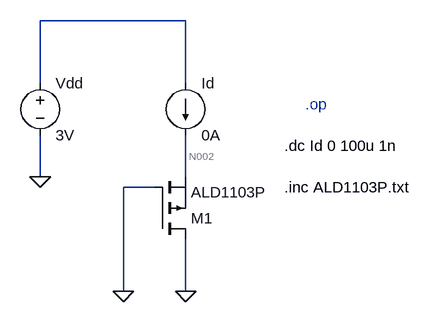
[diagram p0: schematic hw3 pmos sim.asc]
hw3 pmos sim.asc, the LTspice schematic file:
Version 4.1
SHEET 1 880 680
WIRE 224 -208 0 -208
WIRE 0 -112 0 -208
WIRE 224 -112 224 -208
WIRE 0 32 0 -32
WIRE 224 32 224 -32
WIRE 176 48 128 48
WIRE 128 208 128 48
WIRE 224 208 224 128
FLAG 224 208 0
FLAG 128 208 0
FLAG 0 32 0
SYMBOL pmos 176 128 M180
SYMATTR InstName M1
SYMATTR Value ALD1103P
SYMBOL current 224 -112 R0
SYMATTR InstName Id
SYMATTR Value 0A
SYMBOL voltage 0 -128 R0
WINDOW 123 0 0 Left 0
WINDOW 39 0 0 Left 0
SYMATTR InstName Vdd
SYMATTR Value 3V
TEXT 376 -16 Left 2 !.dc Id 0 100u 1n
TEXT 376 48 Left 2 !.inc ALD1103P.txt
TEXT 408 -80 Left 2 ;.op

The netlist it stands for:
* hw3 pmos sim.asc
M1 0 0 N002 N002 ALD1103P
Id N001 N002 0A
Vdd N001 0 3V
.model NMOS NMOS
.model PMOS PMOS
.lib standard.mos
.dc Id 0 100u 1n
.inc ALD1103P.txt
* .op
.backanno
.end

* Results of the author's LTspice run, read from the files saved beside the schematic
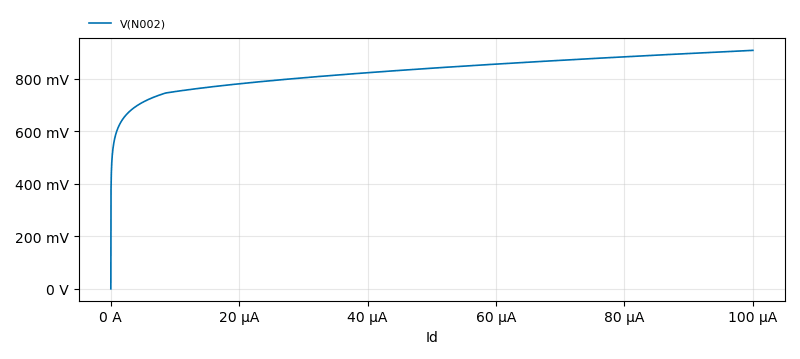
[diagram p1: DC transfer characteristic of hw3 pmos sim.asc, plotted from the saved traces]
* DC transfer characteristic, 1 run:
*   V(N002): -2.796e-06 fV at Id=0 A, 909.1 mV at Id=100 µA, min -2.796e-06 fV, max 909.1 mV